# Altium schematic sheet Interface.SchDoc
size A; SheetNumber: 4; SheetTotal: 5
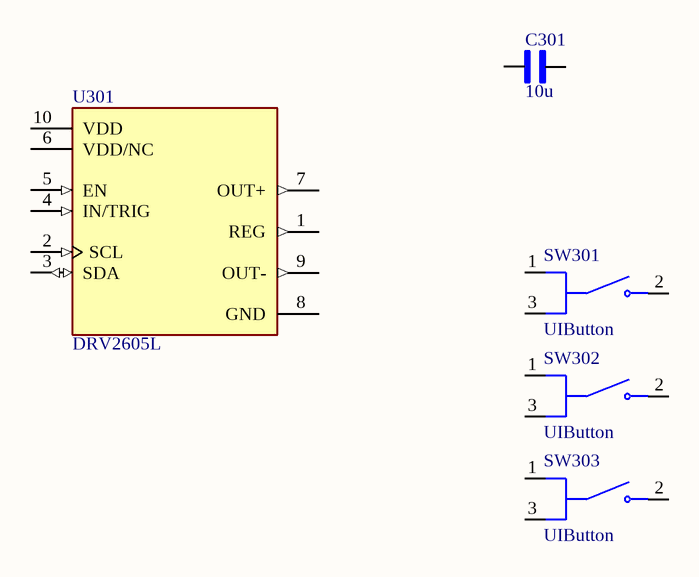
[diagram p0: Interface.SchDoc]

## Parts
C301  10u  [0603c]
SW301  UIButton  [TL3340AF160QG]
SW302  UIButton  [TL3340AF160QG]
SW303  UIButton  [TL3340AF160QG]
U301  DRV2605L  [DRV2605L]

## Nets

Not connected (* = marked no-connect by the designer): C301 1 2; SW301 1(COM_1) 2(NO) 3(COM_2); SW302 1(COM_1) 2(NO) 3(COM_2); SW303 1(COM_1) 2(NO) 3(COM_2); U301 1(REG) 2(SCL) 3(SDA) 4(IN/TRIG) 5(EN) 6(VDD/NC) 7(OUT+) 8(GND) 9(OUT-) 10(VDD)

## Library data of the parts
C301 = 0603c
SW301-SW303 = TL3340AF160QG